# EAGLE schematic Stencil (EAGLE 7.7.0)
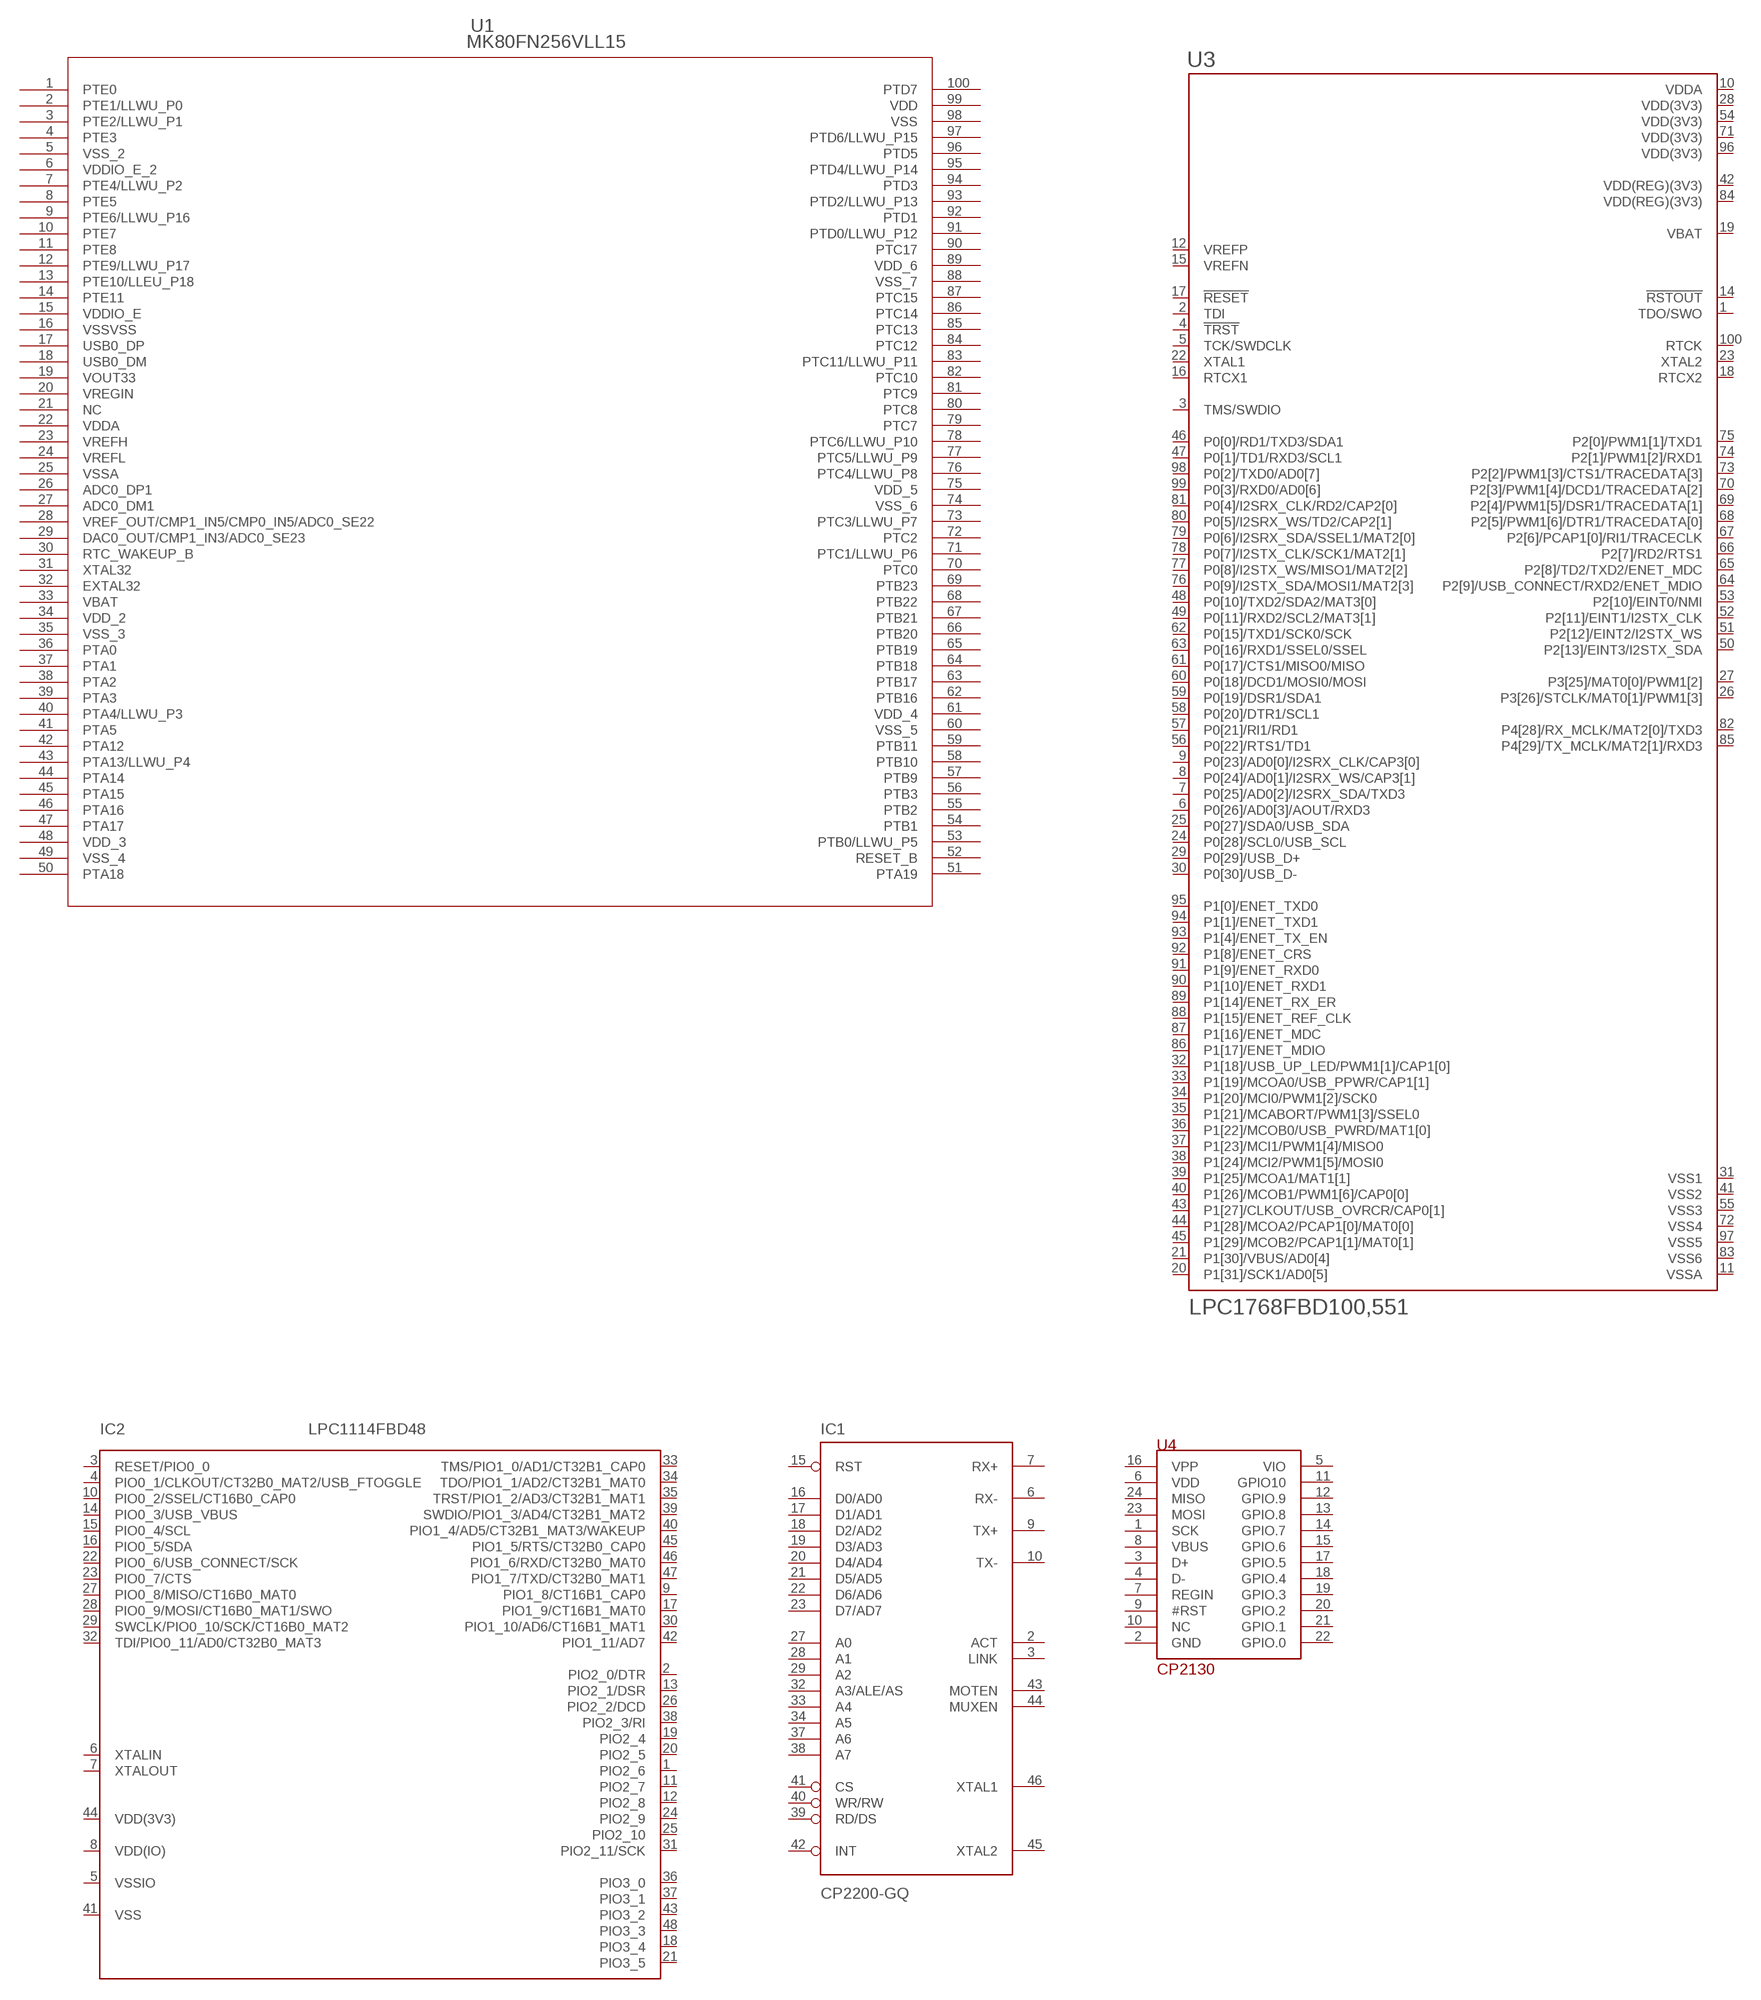
[diagram p0: schematic, sheet 1, part 1 of 2]
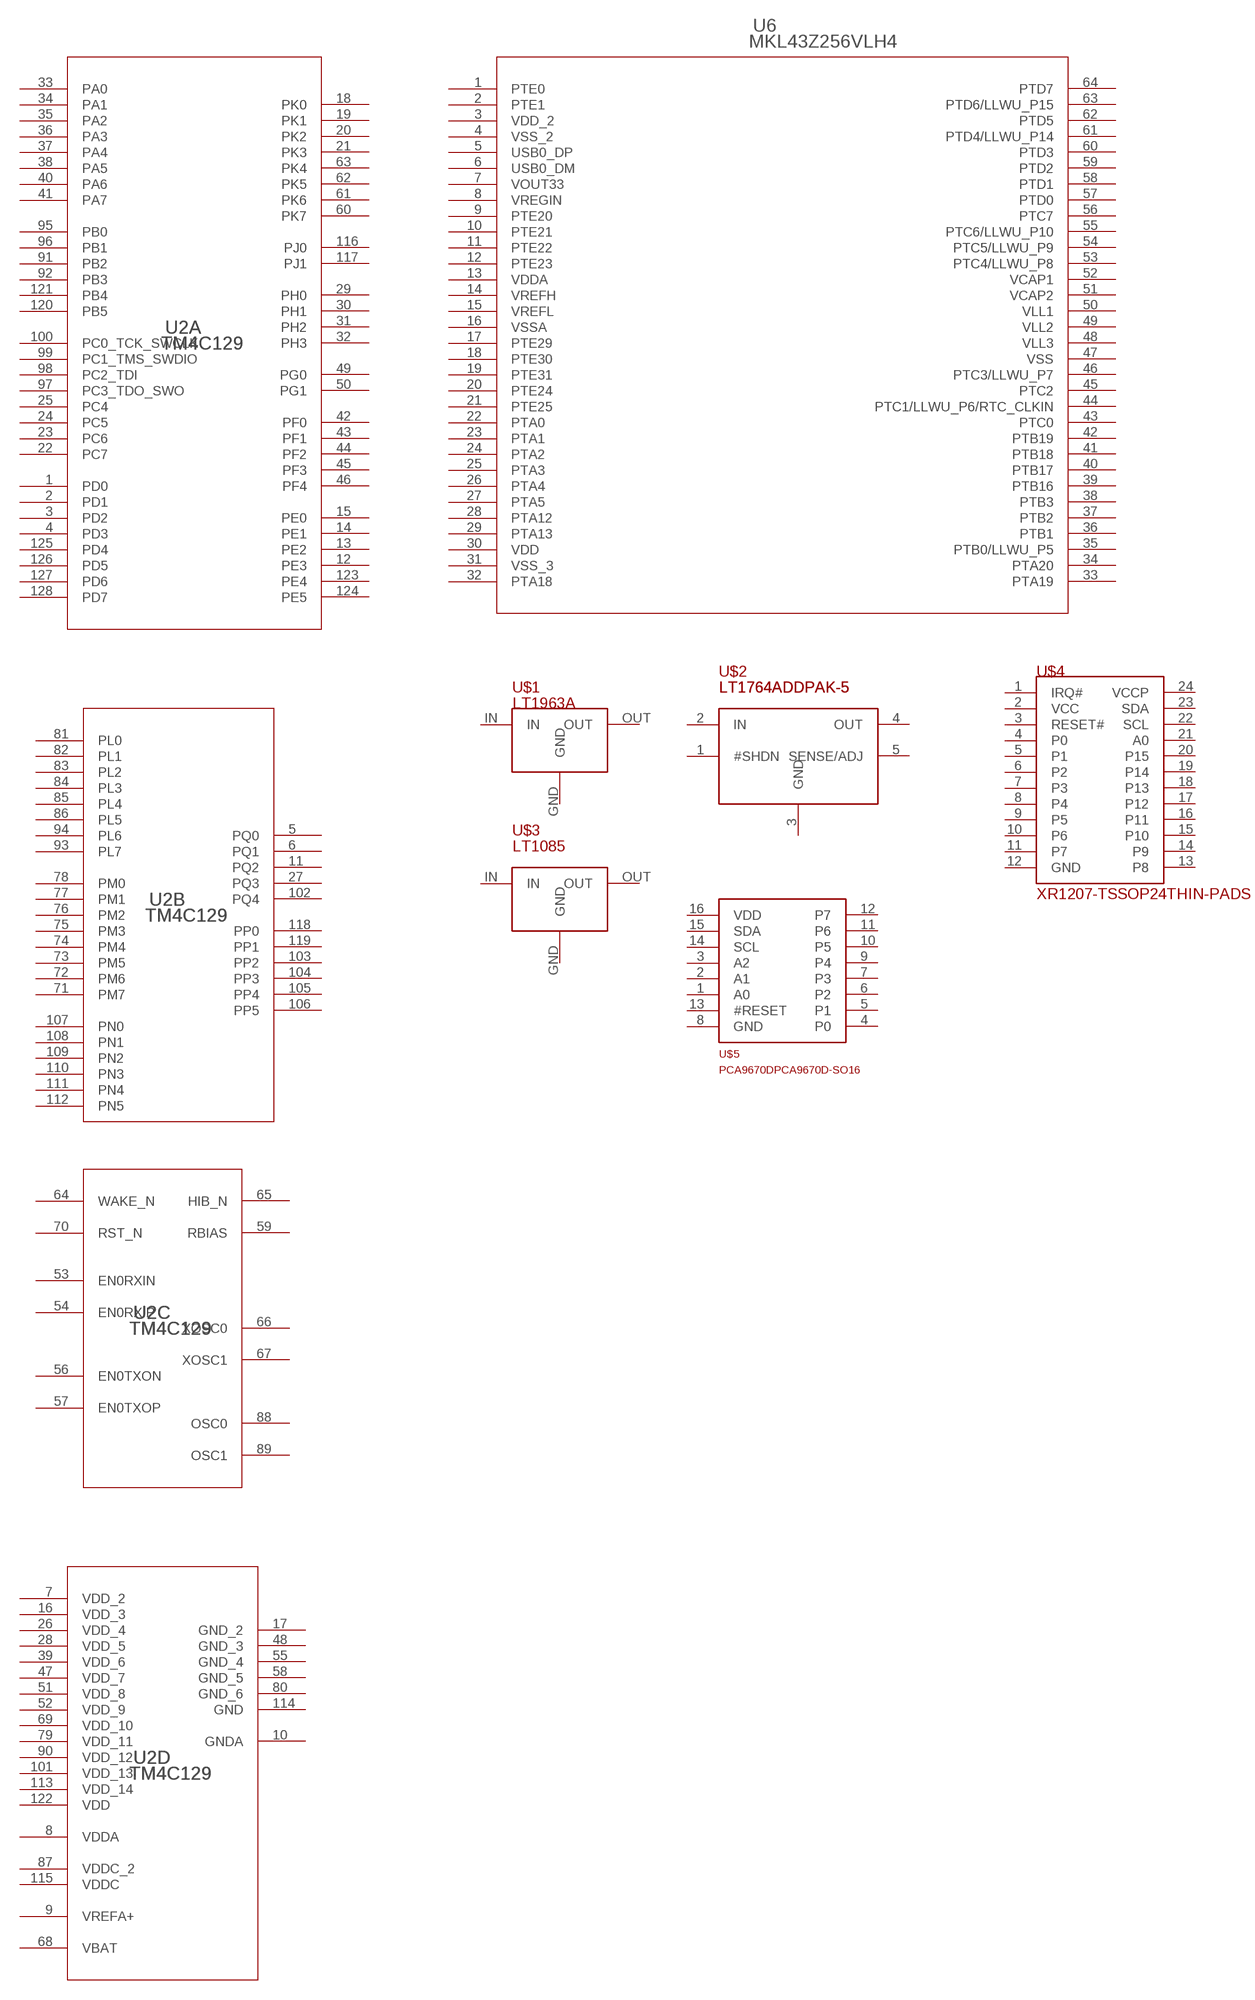
[diagram p1: schematic, sheet 1, part 2 of 2]

## Parts
IC1  CP2200-GQ  [TQFP-48]
IC2  LPC1114FBD48  [LQFP48-7X7]
U1  MK80FN256VLL15  [98ASS23308W]
U2  TM4C129  TM4C129ENCPDTI3R  [PDT0128A_N]
U3  LPC1768FBD100,551  [QFP50P1600X1600X160-100N]
U4  CP2130  [QFN-24]
U6  MKL43Z256VLH4  [LQFP-64_10X10X1.6]
U$1  LT1963A  [ST-3]
U$2  LT1764ADDPAK-5  [DD-5]
U$3  LT1085  [DD-3]
U$4  XR1207-TSSOP24THIN-PADS  [TSSOP-24-THIN-PADS]
U$5  PCA9670DPCA9670D-SO16  [PCA9670D-SO16]
Unconnected: IC1.1(NC1) IC1.2(ACT) IC1.3(LINK) IC1.6(RX-) IC1.7(RX+) IC1.8(NC2) IC1.9(TX+) IC1.10(TX-) IC1.11(NC3) IC1.12(NC4) IC1.15(RST) IC1.16(D0/AD0) IC1.17(D1/AD1) IC1.18(D2/AD2) IC1.19(D3/AD3) IC1.20(D4/AD4) IC1.21(D5/AD5) IC1.22(D6/AD6) IC1.23(D7/AD7) IC1.24(NC5) IC1.25(NC6) IC1.26(NC7) IC1.27(A0) IC1.28(A1) IC1.29(A2) IC1.32(A3/ALE/AS) IC1.33(A4) IC1.34(A5) IC1.35(NC8) IC1.36(NC9) IC1.37(A6) IC1.38(A7) IC1.39(RD/DS) IC1.40(WR/RW) IC1.41(CS) IC1.42(INT) IC1.43(MOTEN) IC1.44(MUXEN) IC1.45(XTAL2) IC1.46(XTAL1) IC1.47(NC10) IC1.48(NC11) IC2.1(PIO2_6) IC2.2(PIO2_0/DTR) IC2.3(RESET/PIO0_0) IC2.4(PIO0_1/CLKOUT/CT32B0_MAT2/USB_FTOGGLE) IC2.6(XTALIN) IC2.7(XTALOUT) IC2.9(PIO1_8/CT16B1_CAP0) IC2.10(PIO0_2/SSEL/CT16B0_CAP0) IC2.11(PIO2_7) IC2.12(PIO2_8) IC2.13(PIO2_1/DSR) IC2.14(PIO0_3/USB_VBUS) IC2.15(PIO0_4/SCL) IC2.16(PIO0_5/SDA) IC2.17(PIO1_9/CT16B1_MAT0) IC2.18(PIO3_4) IC2.19(PIO2_4) IC2.20(PIO2_5) IC2.21(PIO3_5) IC2.22(PIO0_6/USB_CONNECT/SCK) IC2.23(PIO0_7/CTS) IC2.24(PIO2_9) IC2.25(PIO2_10) IC2.26(PIO2_2/DCD) IC2.27(PIO0_8/MISO/CT16B0_MAT0) IC2.28(PIO0_9/MOSI/CT16B0_MAT1/SWO) IC2.29(SWCLK/PIO0_10/SCK/CT16B0_MAT2) IC2.30(PIO1_10/AD6/CT16B1_MAT1) IC2.31(PIO2_11/SCK) IC2.32(TDI/PIO0_11/AD0/CT32B0_MAT3) IC2.33(TMS/PIO1_0/AD1/CT32B1_CAP0) IC2.34(TDO/PIO1_1/AD2/CT32B1_MAT0) IC2.35(TRST/PIO1_2/AD3/CT32B1_MAT1) IC2.36(PIO3_0) IC2.37(PIO3_1) IC2.38(PIO2_3/RI) IC2.39(SWDIO/PIO1_3/AD4/CT32B1_MAT2) IC2.40(PIO1_4/AD5/CT32B1_MAT3/WAKEUP) IC2.42(PIO1_11/AD7) IC2.43(PIO3_2) IC2.45(PIO1_5/RTS/CT32B0_CAP0) IC2.46(PIO1_6/RXD/CT32B0_MAT0) IC2.47(PIO1_7/TXD/CT32B0_MAT1) IC2.48(PIO3_3) U1.1(PTE0) U1.2(PTE1/LLWU_P0) U1.3(PTE2/LLWU_P1) U1.4(PTE3) U1.7(PTE4/LLWU_P2) U1.8(PTE5) U1.9(PTE6/LLWU_P16) U1.10(PTE7) U1.11(PTE8) U1.12(PTE9/LLWU_P17) U1.13(PTE10/LLEU_P18) U1.14(PTE11) U1.17(USB0_DP) U1.18(USB0_DM) U1.19(VOUT33) U1.20(VREGIN) U1.21(NC) U1.26(ADC0_DP1) U1.27(ADC0_DM1) U1.28(VREF_OUT/CMP1_IN5/CMP0_IN5/ADC0_SE22) U1.29(DAC0_OUT/CMP1_IN3/ADC0_SE23) U1.30(RTC_WAKEUP_B) U1.31(XTAL32) U1.32(EXTAL32) U1.36(PTA0) U1.37(PTA1) U1.38(PTA2) U1.39(PTA3) U1.40(PTA4/LLWU_P3) U1.41(PTA5) U1.42(PTA12) U1.43(PTA13/LLWU_P4) U1.44(PTA14) U1.45(PTA15) U1.46(PTA16) U1.47(PTA17) U1.50(PTA18) U1.51(PTA19) U1.52(RESET_B) U1.53(PTB0/LLWU_P5) U1.54(PTB1) U1.55(PTB2) U1.56(PTB3) U1.57(PTB9) U1.58(PTB10) U1.59(PTB11) U1.62(PTB16) U1.63(PTB17) U1.64(PTB18) U1.65(PTB19) U1.66(PTB20) U1.67(PTB21) U1.68(PTB22) U1.69(PTB23) U1.70(PTC0) U1.71(PTC1/LLWU_P6) U1.72(PTC2) U1.73(PTC3/LLWU_P7) U1.76(PTC4/LLWU_P8) U1.77(PTC5/LLWU_P9) U1.78(PTC6/LLWU_P10) U1.79(PTC7) U1.80(PTC8) U1.81(PTC9) U1.82(PTC10) U1.83(PTC11/LLWU_P11) U1.84(PTC12) U1.85(PTC13) U1.86(PTC14) U1.87(PTC15) U1.90(PTC17) U1.91(PTD0/LLWU_P12) U1.92(PTD1) U1.93(PTD2/LLWU_P13) U1.94(PTD3) U1.95(PTD4/LLWU_P14) U1.96(PTD5) U1.97(PTD6/LLWU_P15) U1.100(PTD7) U2.1(A:PD0) U2.2(A:PD1) U2.3(A:PD2) U2.4(A:PD3) U2.5(B:PQ0) U2.6(B:PQ1) U2.11(B:PQ2) U2.12(A:PE3) U2.13(A:PE2) U2.14(A:PE1) U2.15(A:PE0) U2.18(A:PK0) U2.19(A:PK1) U2.20(A:PK2) U2.21(A:PK3) U2.22(A:PC7) U2.23(A:PC6) U2.24(A:PC5) U2.25(A:PC4) U2.27(B:PQ3) U2.29(A:PH0) U2.30(A:PH1) U2.31(A:PH2) U2.32(A:PH3) U2.33(A:PA0) U2.34(A:PA1) U2.35(A:PA2) U2.36(A:PA3) U2.37(A:PA4) U2.38(A:PA5) U2.40(A:PA6) U2.41(A:PA7) U2.42(A:PF0) U2.43(A:PF1) U2.44(A:PF2) U2.45(A:PF3) U2.46(A:PF4) U2.49(A:PG0) U2.50(A:PG1) U2.53(C:EN0RXIN) U2.54(C:EN0RXIP) U2.56(C:EN0TXON) U2.57(C:EN0TXOP) U2.59(C:RBIAS) U2.60(A:PK7) U2.61(A:PK6) U2.62(A:PK5) U2.63(A:PK4) U2.64(C:WAKE_N) U2.65(C:HIB_N) U2.66(C:XOSC0) U2.67(C:XOSC1) U2.70(C:RST_N) U2.71(B:PM7) U2.72(B:PM6) U2.73(B:PM5) U2.74(B:PM4) U2.75(B:PM3) U2.76(B:PM2) U2.77(B:PM1) U2.78(B:PM0) U2.81(B:PL0) U2.82(B:PL1) U2.83(B:PL2) U2.84(B:PL3) U2.85(B:PL4) U2.86(B:PL5) U2.88(C:OSC0) U2.89(C:OSC1) U2.91(A:PB2) U2.92(A:PB3) U2.93(B:PL7) U2.94(B:PL6) U2.95(A:PB0) U2.96(A:PB1) U2.97(A:PC3_TDO_SWO) U2.98(A:PC2_TDI) U2.99(A:PC1_TMS_SWDIO) U2.100(A:PC0_TCK_SWCLK) U2.102(B:PQ4) U2.103(B:PP2) U2.104(B:PP3) U2.105(B:PP4) U2.106(B:PP5) U2.107(B:PN0) U2.108(B:PN1) U2.109(B:PN2) U2.110(B:PN3) U2.111(B:PN4) U2.112(B:PN5) U2.116(A:PJ0) U2.117(A:PJ1) U2.118(B:PP0) U2.119(B:PP1) U2.120(A:PB5) U2.121(A:PB4) U2.123(A:PE4) U2.124(A:PE5) U2.125(A:PD4) U2.126(A:PD5) U2.127(A:PD6) U2.128(A:PD7) U3.1(TDO/SWO) U3.2(TDI) U3.3(TMS/SWDIO) U3.4(!TRST) U3.5(TCK/SWDCLK) U3.6(P0[26]/AD0[3]/AOUT/RXD3) U3.7(P0[25]/AD0[2]/I2SRX_SDA/TXD3) U3.8(P0[24]/AD0[1]/I2SRX_WS/CAP3[1]) U3.9(P0[23]/AD0[0]/I2SRX_CLK/CAP3[0]) U3.12(VREFP) U3.14(!RSTOUT) U3.15(VREFN) U3.16(RTCX1) U3.17(!RESET) U3.18(RTCX2) U3.20(P1[31]/SCK1/AD0[5]) U3.21(P1[30]/VBUS/AD0[4]) U3.22(XTAL1) U3.23(XTAL2) U3.24(P0[28]/SCL0/USB_SCL) U3.25(P0[27]/SDA0/USB_SDA) U3.26(P3[26]/STCLK/MAT0[1]/PWM1[3]) U3.27(P3[25]/MAT0[0]/PWM1[2]) U3.29(P0[29]/USB_D+) U3.30(P0[30]/USB_D-) U3.32(P1[18]/USB_UP_LED/PWM1[1]/CAP1[0]) U3.33(P1[19]/MCOA0/USB_PPWR/CAP1[1]) U3.34(P1[20]/MCI0/PWM1[2]/SCK0) U3.35(P1[21]/MCABORT/PWM1[3]/SSEL0) U3.36(P1[22]/MCOB0/USB_PWRD/MAT1[0]) U3.37(P1[23]/MCI1/PWM1[4]/MISO0) U3.38(P1[24]/MCI2/PWM1[5]/MOSI0) U3.39(P1[25]/MCOA1/MAT1[1]) U3.40(P1[26]/MCOB1/PWM1[6]/CAP0[0]) U3.43(P1[27]/CLKOUT/USB_OVRCR/CAP0[1]) U3.44(P1[28]/MCOA2/PCAP1[0]/MAT0[0]) U3.45(P1[29]/MCOB2/PCAP1[1]/MAT0[1]) U3.46(P0[0]/RD1/TXD3/SDA1) U3.47(P0[1]/TD1/RXD3/SCL1) U3.48(P0[10]/TXD2/SDA2/MAT3[0]) U3.49(P0[11]/RXD2/SCL2/MAT3[1]) U3.50(P2[13]/EINT3/I2STX_SDA) U3.51(P2[12]/EINT2/I2STX_WS) U3.52(P2[11]/EINT1/I2STX_CLK) U3.53(P2[10]/EINT0/NMI) U3.56(P0[22]/RTS1/TD1) U3.57(P0[21]/RI1/RD1) U3.58(P0[20]/DTR1/SCL1) U3.59(P0[19]/DSR1/SDA1) U3.60(P0[18]/DCD1/MOSI0/MOSI) U3.61(P0[17]/CTS1/MISO0/MISO) U3.62(P0[15]/TXD1/SCK0/SCK) U3.63(P0[16]/RXD1/SSEL0/SSEL) U3.64(P2[9]/USB_CONNECT/RXD2/ENET_MDIO) U3.65(P2[8]/TD2/TXD2/ENET_MDC) U3.66(P2[7]/RD2/RTS1) U3.67(P2[6]/PCAP1[0]/RI1/TRACECLK) U3.68(P2[5]/PWM1[6]/DTR1/TRACEDATA[0]) U3.69(P2[4]/PWM1[5]/DSR1/TRACEDATA[1]) U3.70(P2[3]/PWM1[4]/DCD1/TRACEDATA[2]) U3.73(P2[2]/PWM1[3]/CTS1/TRACEDATA[3]) U3.74(P2[1]/PWM1[2]/RXD1) U3.75(P2[0]/PWM1[1]/TXD1) U3.76(P0[9]/I2STX_SDA/MOSI1/MAT2[3]) U3.77(P0[8]/I2STX_WS/MISO1/MAT2[2]) U3.78(P0[7]/I2STX_CLK/SCK1/MAT2[1]) U3.79(P0[6]/I2SRX_SDA/SSEL1/MAT2[0]) U3.80(P0[5]/I2SRX_WS/TD2/CAP2[1]) U3.81(P0[4]/I2SRX_CLK/RD2/CAP2[0]) U3.82(P4[28]/RX_MCLK/MAT2[0]/TXD3) U3.85(P4[29]/TX_MCLK/MAT2[1]/RXD3) U3.86(P1[17]/ENET_MDIO) U3.87(P1[16]/ENET_MDC) U3.88(P1[15]/ENET_REF_CLK) U3.89(P1[14]/ENET_RX_ER) U3.90(P1[10]/ENET_RXD1) U3.91(P1[9]/ENET_RXD0) U3.92(P1[8]/ENET_CRS) U3.93(P1[4]/ENET_TX_EN) U3.94(P1[1]/ENET_TXD1) U3.95(P1[0]/ENET_TXD0) U3.98(P0[2]/TXD0/AD0[7]) U3.99(P0[3]/RXD0/AD0[6]) U3.100(RTCK) U4.1(SCK) U4.2(GND) U4.3(D+) U4.4(D-) U4.5(VIO) U4.6(VDD) U4.7(REGIN) U4.8(VBUS) U4.9(#RST) U4.10(NC) U4.11(GPIO10) U4.12(GPIO.9) U4.13(GPIO.8) U4.14(GPIO.7) U4.15(GPIO.6) U4.16(VPP) U4.17(GPIO.5) U4.18(GPIO.4) U4.19(GPIO.3) U4.20(GPIO.2) U4.21(GPIO.1) U4.22(GPIO.0) U4.23(MOSI) U4.24(MISO) U6.1(PTE0) U6.2(PTE1) U6.5(USB0_DP) U6.6(USB0_DM) U6.7(VOUT33) U6.8(VREGIN) U6.9(PTE20) U6.10(PTE21) U6.11(PTE22) U6.12(PTE23) U6.17(PTE29) U6.18(PTE30) U6.19(PTE31) U6.20(PTE24) U6.21(PTE25) U6.22(PTA0) U6.23(PTA1) U6.24(PTA2) U6.25(PTA3) U6.26(PTA4) U6.27(PTA5) U6.28(PTA12) U6.29(PTA13) U6.32(PTA18) U6.33(PTA19) U6.34(PTA20) U6.35(PTB0/LLWU_P5) U6.36(PTB1) U6.37(PTB2) U6.38(PTB3) U6.39(PTB16) U6.40(PTB17) U6.41(PTB18) U6.42(PTB19) U6.43(PTC0) U6.44(PTC1/LLWU_P6/RTC_CLKIN) U6.45(PTC2) U6.46(PTC3/LLWU_P7) U6.53(PTC4/LLWU_P8) U6.54(PTC5/LLWU_P9) U6.55(PTC6/LLWU_P10) U6.56(PTC7) U6.57(PTD0) U6.58(PTD1) U6.59(PTD2) U6.60(PTD3) U6.61(PTD4/LLWU_P14) U6.62(PTD5) U6.63(PTD6/LLWU_P15) U6.64(PTD7) U$1.GND U$1.IN U$1.OUT U$2.1(#SHDN) U$2.2(IN) U$2.3(GND) U$2.4(OUT) U$2.5(SENSE/ADJ) U$3.GND U$3.IN U$3.OUT U$4.1(IRQ#) U$4.2(VCC) U$4.3(RESET#) U$4.4(P0) U$4.5(P1) U$4.6(P2) U$4.7(P3) U$4.8(P4) U$4.9(P5) U$4.10(P6) U$4.11(P7) U$4.12(GND) U$4.13(P8) U$4.14(P9) U$4.15(P10) U$4.16(P11) U$4.17(P12) U$4.18(P13) U$4.19(P14) U$4.20(P15) U$4.21(A0) U$4.22(SCL) U$4.23(SDA) U$4.24(VCCP) U$5.1(A0) U$5.2(A1) U$5.3(A2) U$5.4(P0) U$5.5(P1) U$5.6(P2) U$5.7(P3) U$5.8(GND) U$5.9(P4) U$5.10(P5) U$5.11(P6) U$5.12(P7) U$5.13(#RESET) U$5.14(SCL) U$5.15(SDA) U$5.16(VDD)

## Power pins joined to a net without a drawn wire
AGND: IC1.4(AGND)
AV+: IC1.5(AV+)
DGND1: IC1.14(DGND1)
DGND2: IC1.31(DGND2)
GND: U2.114(D:GND)
GND_2: U2.17(D:GND_2)
GND_3: U2.48(D:GND_3)
GND_4: U2.55(D:GND_4)
GND_5: U2.58(D:GND_5)
GND_6: U2.80(D:GND_6)
GNDA: U2.10(D:GNDA)
VBAT: U1.33(VBAT) U2.68(D:VBAT) U3.19(VBAT)
VCAP1: U6.52(VCAP1)
VCAP2: U6.51(VCAP2)
VDD: U1.99(VDD) U2.122(D:VDD) U6.30(VDD)
VDD1: IC1.13(VDD1)
VDD2: IC1.30(VDD2)
VDD(3V3): IC2.44(VDD(3V3)) U3.28(VDD(3V3)) U3.54(VDD(3V3)) U3.71(VDD(3V3)) U3.96(VDD(3V3))
VDD(IO): IC2.8(VDD(IO))
VDD(REG)(3V3): U3.42(VDD(REG)(3V3)) U3.84(VDD(REG)(3V3))
VDD_2: U1.34(VDD_2) U2.7(D:VDD_2) U6.3(VDD_2)
VDD_3: U1.48(VDD_3) U2.16(D:VDD_3)
VDD_4: U1.61(VDD_4) U2.26(D:VDD_4)
VDD_5: U1.75(VDD_5) U2.28(D:VDD_5)
VDD_6: U1.89(VDD_6) U2.39(D:VDD_6)
VDD_7: U2.47(D:VDD_7)
VDD_8: U2.51(D:VDD_8)
VDD_9: U2.52(D:VDD_9)
VDD_10: U2.69(D:VDD_10)
VDD_11: U2.79(D:VDD_11)
VDD_12: U2.90(D:VDD_12)
VDD_13: U2.101(D:VDD_13)
VDD_14: U2.113(D:VDD_14)
VDDA: U1.22(VDDA) U2.8(D:VDDA) U3.10(VDDA) U6.13(VDDA)
VDDC: U2.115(D:VDDC)
VDDC_2: U2.87(D:VDDC_2)
VDDIO_E: U1.15(VDDIO_E)
VDDIO_E_2: U1.6(VDDIO_E_2)
VLL1: U6.50(VLL1)
VLL2: U6.49(VLL2)
VLL3: U6.48(VLL3)
VREFA+: U2.9(D:VREFA+)
VREFH: U1.23(VREFH) U6.14(VREFH)
VREFL: U1.24(VREFL) U6.15(VREFL)
VSS: IC2.41(VSS) U1.98(VSS) U6.47(VSS)
VSS1: U3.31(VSS1)
VSS2: U3.41(VSS2)
VSS3: U3.55(VSS3)
VSS4: U3.72(VSS4)
VSS5: U3.97(VSS5)
VSS6: U3.83(VSS6)
VSS_2: U1.5(VSS_2) U6.4(VSS_2)
VSS_3: U1.35(VSS_3) U6.31(VSS_3)
VSS_4: U1.49(VSS_4)
VSS_5: U1.60(VSS_5)
VSS_6: U1.74(VSS_6)
VSS_7: U1.88(VSS_7)
VSSA: U1.25(VSSA) U3.11(VSSA) U6.16(VSSA)
VSSIO: IC2.5(VSSIO)
VSSVSS: U1.16(VSSVSS)

## Library data of the parts
IC1 = silabs-eth:CP2200-GQ: SINGLE-CHIP ETHERNET CONTROLLER The CP2200 has an IEEE 802.3 compliant 10 BASE-T Ethernet
IC2 = lpc1xxx-v6:LPC1114FBD48: LPC1114 50 MHz 32-bit ARM Cortex-M0 based microcontroller featuring a high level of integration and very low power consumption. 32 kB Flash, 8 or 4 kB SRAM MarcVl - Datasheet available on www.nxp.com
U1 = SistemaCendit11713:MK80FN256VLL15; MANUFACTURER_PART_NUMBER: mk80fn256vll15; VENDOR: Freescale
U2 = EagleLib:TM4C129ENCPDTI3R; ALTERNATEPARTNUMBER: TM4C129ENCPDTI3; APPLICATION_BUILDNUMBER: *; COMPTYPE: IC; MANUFACTURER: Texas Instruments; MOUNTTYPE: SMT; PACKAGEREFERENCE: PDT0128A; PARTNUMBER: TM4C129ENCPDTI3R; PIN_COUNT: 128; REFDES: RefDes; ROHS: Y; TYPE: TYPE; VALUE: Value
U3 = LPC1768FBD100_551:LPC1768FBD100,551: LPC1768 Series 64 kB 100 MHz 32-Bit ARM Cortex M3 Microcontroller - LQFP-100; AVAILABILITY: Good; DESCRIPTION: LPC1768 Series 64 kB 100 MHz 32-Bit ARM Cortex M3 Microcontroller - LQFP-100; MF: NXP Semiconductors; MP: LPC1768FBD100,551; PACKAGE: LQFP-100 NXP Semiconductors; PRICE: 8.30 USD
U4 = EagleLib:CP2130
U6 = SistemaCendit11713v2:MKL43Z256VLH4; CPU: ARM CortexM0+; FLASHKB: 256; MANUFACTURER_PART_NUMBER: mkl43z256vlh4; MAXFREQUENCY: 48; PINCOUNT: 64; SRAMKB: 32; VENDOR: FREESCALE
U$1 = SistemaCendit11713v2:LT1963A
U$2 = SistemaCendit11713v2:LT1764A
U$3 = SistemaCendit11713v2:LT1085
U$4 = JoseAriasEagleLib:XR1207-TSSOP24
U$5 = JoseAriasEagleLib:PCA9670D